# Altium project USB_Isolator.PrjPcb
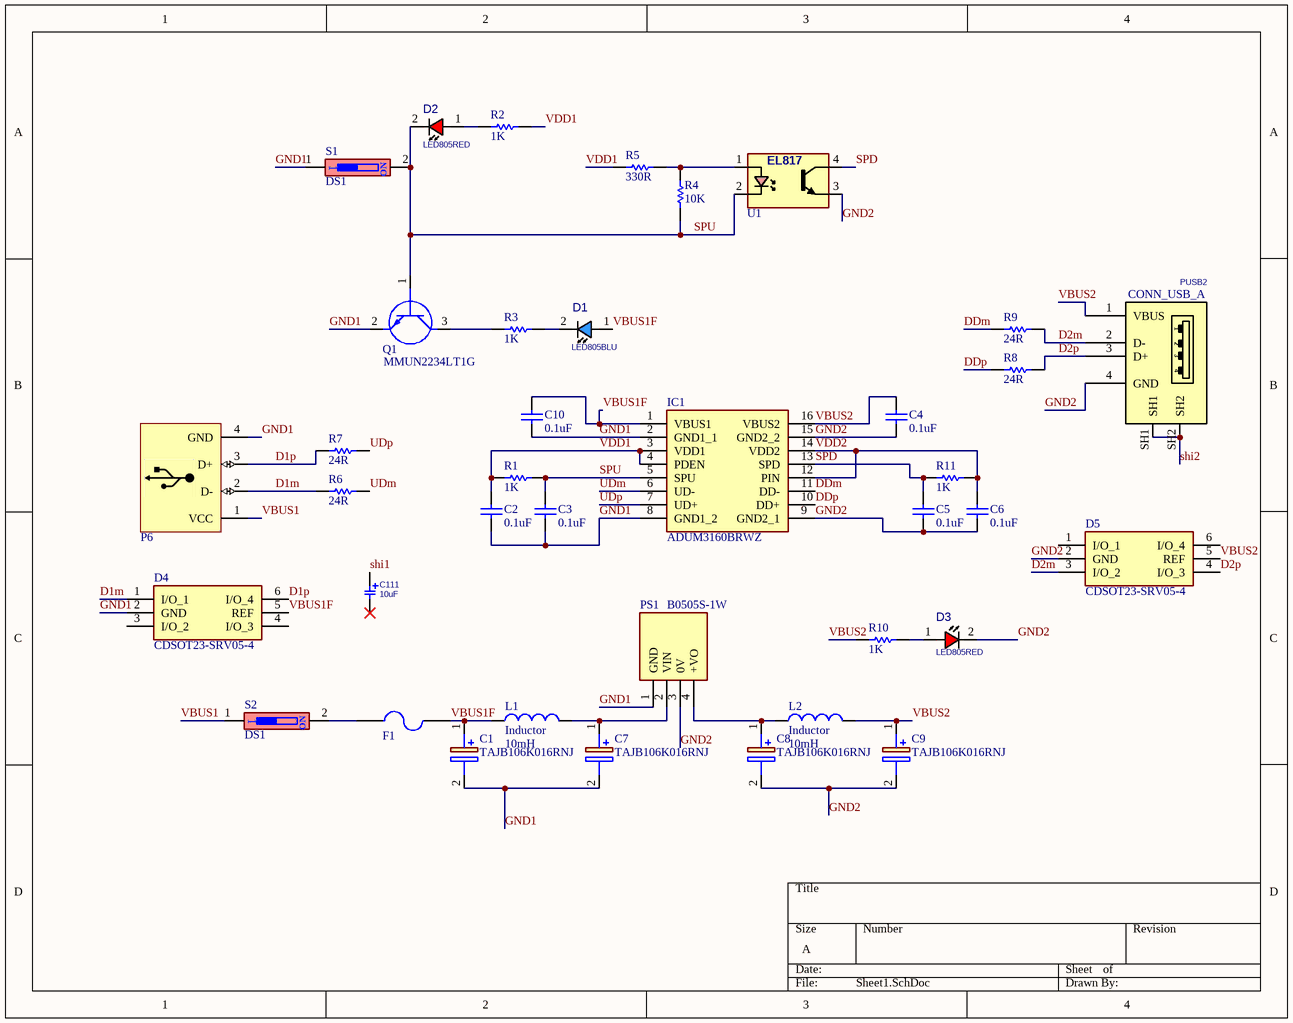
[diagram p0: Sheet1.SchDoc]
1 sheet, 38 parts. Net scope: global (net labels, ports and power ports of the same name join across sheets).
Board files: PCB1.PcbDoc, PCB2.PcbDoc

## Sheet Sheet1.SchDoc
size A

### Parts
C1  TAJB106K016RNJ  [CAPPM3528X210N]
C2  0.1uF  [CAPC3413X12N]
C3  0.1uF  [CAPC3413X12N]
C4  0.1uF  [CAPC3413X12N]
C5  0.1uF  [CAPC3413X12N]
C6  0.1uF  [CAPC3413X12N]
C7  TAJB106K016RNJ  [CAPPM3528X210N]
C8  TAJB106K016RNJ  [CAPPM3528X210N]
C9  TAJB106K016RNJ  [CAPPM3528X210N]
C10  0.1uF  [CAPC3413X12N]
C111  10uF  [IND0805]
D1  LED805BLU  [LED0805BLU]
D2  LED805RED  [LED0805RED]
D3  LED805RED  [LED0805RED]
D4  CDSOT23-SRV05-4  [SOT95P280X145-6N]
D5  CDSOT23-SRV05-4  [SOT95P280X145-6N]
F1  F=1.0 A  [1206 FUSE]  (value not drawn)
IC1  ADUM3160BRWZ  [SOIC127P1032X265-16N]
L1  Inductor  value 10mH  [INDC3216]
L2  Inductor  value 10mH  [INDC3216]
P6  USB Connector  [USB2.5-2H4F]  (value not drawn)
PS1  B0505S-1W  [B0505S1W]
PUSB2  CONN_USB_A  [USB_A_REC_RA_THD]
Q1  MMUN2234LT1G  [SOT23_3]
R1  1K  [RESC3413X04N]
R2  1K  [RESC3413X04N]
R3  1K  [RESC3413X04N]
R4  10K  [RESC3413X04N]
R5  330R  [RESC3413X04N]
R6  24R  [RESC3413X04N]
R7  24R  [RESC3413X04N]
R8  24R  [RESC3413X04N]
R9  24R  [RESC3413X04N]
R10  1K  [RESC3413X04N]
R11  1K  [RESC3413X04N]
S1  DS1  [DIP Switch x1]
S2  DS1  [DIP Switch x1]
U1  EL817  [DIP_4]  (value not drawn)

### Nets
D1m: D4.1(I/O_1) P6.2(D-) R6.1
D1p: D4.6(I/O_4) P6.3(D+) R7.1
D2m: D5.3(I/O_2) PUSB2.2(D-) R9.2
D2p: D5.4(I/O_3) PUSB2.3(D+) R8.2
DDm: IC1.11(DD-) R9.1
DDp: IC1.10(DD+) R8.1
GND1: C1.2(-) C2.1 C3.1 C7.2(-) C10.1 D4.2(GND) IC1.2(GND1_1) IC1.8(GND1_2) P6.4(GND) PS1.1(GND) Q1.2(E) S1.1
GND2: C4.1 C5.1 C6.1 C8.2(-) C9.2(-) D3.2(CATHODE) D5.2(GND) IC1.9(GND2_1) IC1.15(GND2_2) PS1.3(0V) PUSB2.4(GND) U1.3(E)
shi1: C111.1
shi2: PUSB2.SH1 PUSB2.SH2
SPD: C5.2 IC1.13(SPD) R11.1 U1.4(C)
SPU: C3.2 D2.2(CATHODE) IC1.5(SPU) Q1.1(B) R1.2 R4.2 S1.2 U1.2(K)
UDm: IC1.6(UD-) R6.2
UDp: IC1.7(UD+) R7.2
VBUS1: P6.1(VCC) S2.1
VBUS1F: C1.1(+) C10.2 D1.1(ANODE) D4.5(REF) F1.2 IC1.1(VBUS1) L1.1
VBUS2: C4.2 C9.1(+) D5.5(REF) IC1.16(VBUS2) L2.2 PUSB2.1(VBUS) R10.1
VDD1: C2.2 IC1.3(VDD1) IC1.4(PDEN) R1.1 R2.1 R5.1
VDD2: C6.2 IC1.12(PIN) IC1.14(VDD2) R11.2
NetC7_1: C7.1(+) L1.2 PS1.2(VIN)
NetC8_1: C8.1(+) L2.1 PS1.4(+VO)
NetD1_2: D1.2(CATHODE) R3.2
NetD2_1: D2.1(ANODE) R2.2
NetD3_1: D3.1(ANODE) R10.2
NetF1_1: F1.1 S2.2
NetQ1_3: Q1.3(C) R3.1
NetR4_1: R4.1 R5.2 U1.1(A)

Not connected (* = marked no-connect by the designer): C111 2*; D4 3(I/O_2) 4(I/O_3); D5 1(I/O_1) 6(I/O_4)

### Notes on the sheet
- (in symbol DIP Switch 1) ON

### Library data of the parts
C1 C7-C9 = TAJB106K016RNJ: Capacitor Polarised; Manufacturer_Name: AVX; Datasheet Link: http://datasheets.avx.com/TAJ.pdf; Height: 2.1mm; Manufacturer_Part_Number: TAJB106K016RNJ; Mouser Part Number: 581-TAJB106K016; Mouser Price/Stock: https://www.mouser.co.uk/ProductDetail/AVX/TAJB106K016RNJ?qs=wgedUHV26DXzpWCLxWDqDw%3D%3D; Arrow Part Number: TAJB106K016RNJ; Arrow Price/Stock: https://www.arrow.com/en/products/tajb106k016rnj/avx
C2-C6 C10 = CAP SMD 0805: CAP 0805; Designer: Abbas Basereh; Desc.: CAP SMD 0805; Data: 16-12-2016
C111 = CAP_SMD_TAN_3216: CAP, SMD, TAN,; PARAM2: -V; VALUE: 10uF
D1 = LED_SMD_0805_BLU: LED, SMD, 0805, BLUE; DESC: DESCRIPTION; MANF_P#: MANF_PART#; PARAM2: 2.2V; MANF: MANF; ASSEMBLY: ASSEMBLY; PRICE: 36t@Javan; VALUE: LED805BLU
D2 D3 = LED_SMD_0805_RED: LED, SMD, 0805, RED; DESC: DESCRIPTION; MANF_P#: MANF_PART#; PARAM2: 2.2V; MANF: MANF; ASSEMBLY: ASSEMBLY; PRICE: 36t@Javan; VALUE: LED805RED
D4 D5 = CDSOT23-SRV05-4: TVS Diode (Uni-directional); Manufacturer_Name: Bourns; Datasheet Link: https://www.bourns.com/docs/Product-Datasheets/CDSOT23-SRV05-4.pdf; Height: 1.45mm; Manufacturer_Part_Number: CDSOT23-SRV05-4; Mouser Part Number: 652-CDSOT23-SRV05-4; Mouser Price/Stock: https://www.mouser.co.uk/ProductDetail/Bourns/CDSOT23-SRV05-4/?qs=y169g2bsK9oS5rHKLe0eWA%3D%3D; Arrow Part Number: CDSOT23-SRV05-4; Arrow Price/Stock: https://www.arrow.com/en/products/cdsot23-srv05-4/bourns
F1 = Fuse SMD1206: SMD Fuses 1206; Designer: Abbas Basereh; Desc.: SMD Fuses 1206; Data: 16-12-2016
IC1 = ADUM3160BRWZ: Integrated Circuit; Manufacturer_Name: Analog Devices; Datasheet Link: http://www.analog.com/media/en/technical-documentation/data-sheets/ADuM3160.pdf; Height: 2.65mm; Manufacturer_Part_Number: ADUM3160BRWZ; Mouser Part Number: 584-ADUM3160BRWZ; Mouser Price/Stock: https://www.mouser.co.uk/ProductDetail/Analog-Devices/ADUM3160BRWZ/?qs=WIvQP4zGanjmPiCfFUKkZQ%3D%3D; Arrow Part Number: ADUM3160BRWZ; Arrow Price/Stock: https://www.arrow.com/en/products/adum3160brwz/analog-devices
L1 L2 = Inductor: Code_IEC: 1005; Published: 8-Jun-2000; LatestRevisionDate: 29-May-2009; LatestRevisionNote: IPC-7351 Footprint Added.; PackageReference: 0402-A; Publisher: Altium Limited; PackageDescription: Chip Inductor; Code_JEITA: 0402
P6 = USB B-Type: USB Connector-B Type; Adding Date: 10/26/2010
PS1 = B0505S-1W: Power Supply; Manufacturer_Name: Mornsun; Datasheet Link: https://www.mornsun-power.com/uploads/pdf/B_D-1W.pdf; Height: 10.41mm; Manufacturer_Part_Number: B0505S-1W
PUSB2 = CONN_USB_A_REC_RA_THD: CONN, USB, A, RECEPTACLE, R/A, THD; VALUE: CONN_USB_A
Q1 = MMUN2234LT1G: Transistor BJT NPN; Manufacturer_Name: ON Semiconductor; Datasheet Link: http://www.onsemi.com/pub/Collateral/DTC124X-D.PDF; Height: 1.11mm; Manufacturer_Part_Number: MMUN2234LT1G; Mouser Part Number: 863-MMUN2234LT1G; Mouser Price/Stock: https://www.mouser.com/Search/Refine.aspx?Keyword=863-MMUN2234LT1G; Arrow Part Number: MMUN2234LT1G; Arrow Price/Stock: https://www.arrow.com/en/products/mmun2234lt1g/on-semiconductor
R1-R11 = RES 0805 0.125W: RES 0805; Designer: Abbas Basereh; Desc.: RES SMD 0805; Data: 16-12-2016
S1 S2 = DIP Switch 1: 1 BIT DIP Switch
U1 = OPTC_TR4P_EL817: OPTOCOUPLER, TRANSISTOR, 4PIN; PARAM: IF=5mA; PARAM2: VCE = 5V; PRICE: 300t@Paya; VALUE: EL817